# EasyEDA Pro project sony_flash.eprj

# Schematic Schematic1
Board Name: Board1; Create Date: 2025-07-01; Page Name: P1; Project Name: sony_flash; Schematic Name: Schematic1; Update Date: 2025-09-16; Company: 嘉立创EDA; Page Size: A4; Version: V1.0
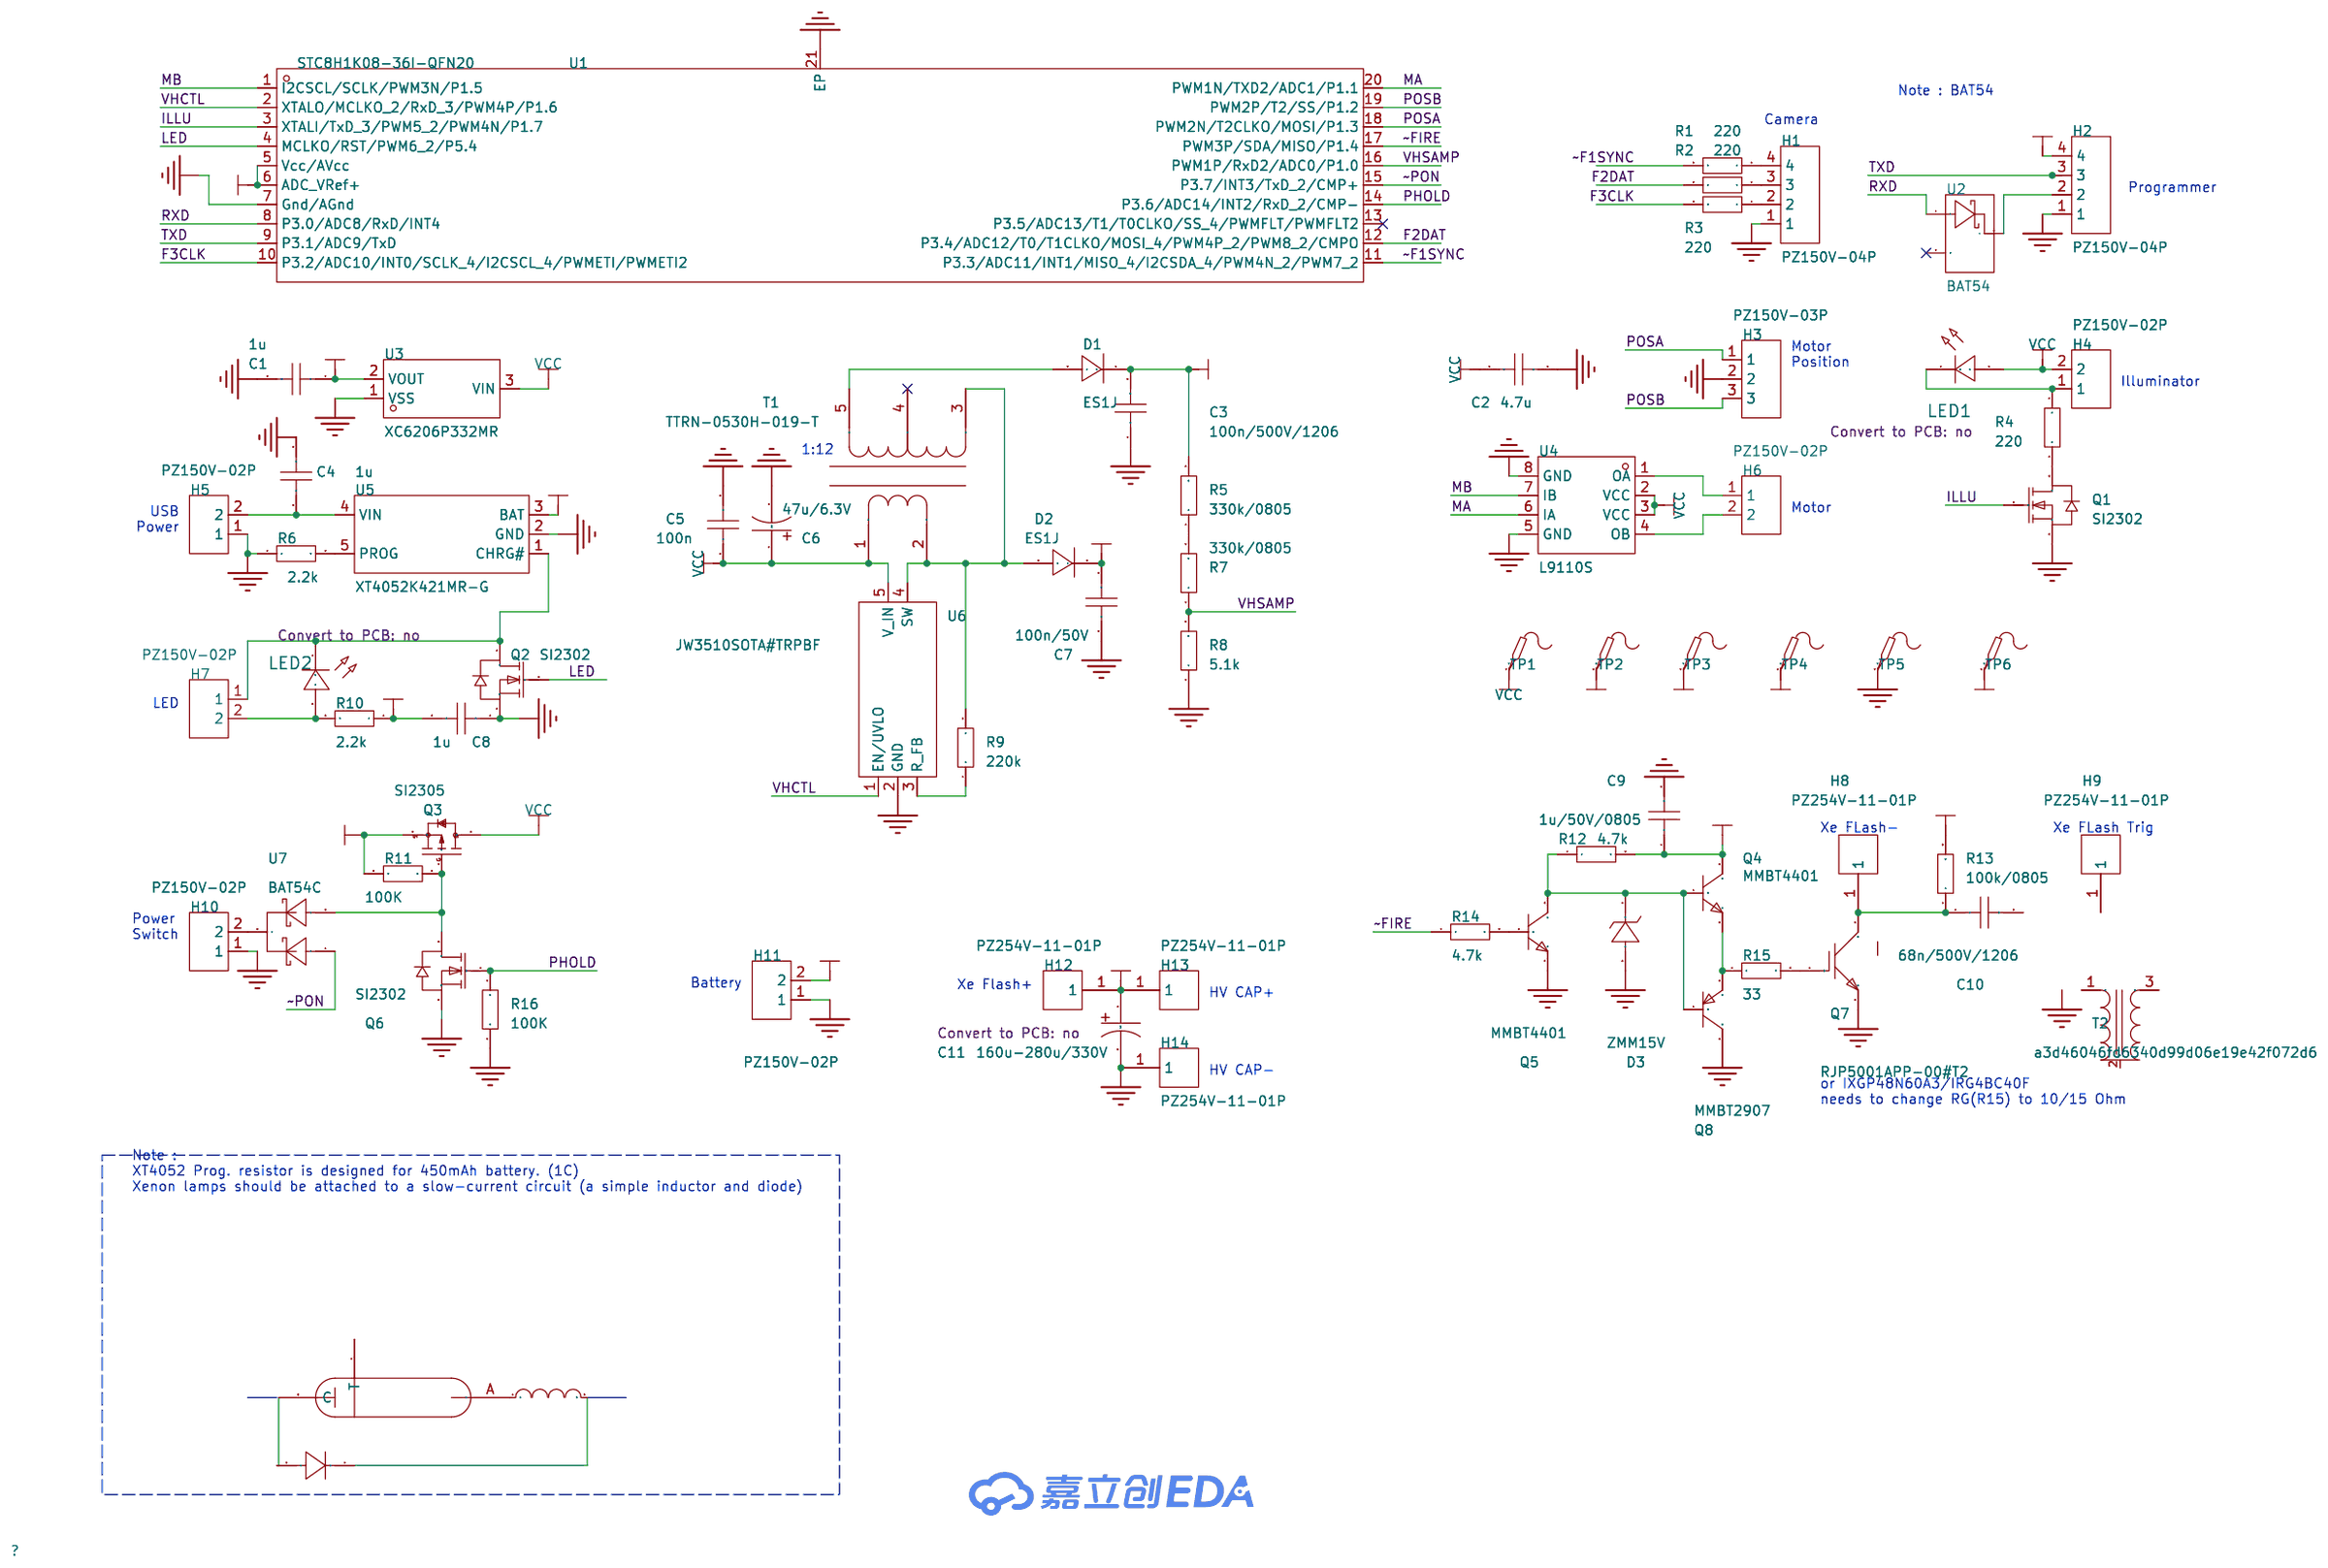
[diagram p0: schematic sheet]

## Parts
C1  1u  [C0603]
C2  4.7u  [C0603]
C3  100n/500V/1206  [C1206]
C4  1u  [C0603]
C5  100n  [C0603]
C6  47u/6.3V  [CAP-SMD_L3.2-W1.6]
C7  100n/50V  [C0603]
C8  1u  [C0603]
C9  1u/50V/0805  [C0805]
C10  68n/500V/1206  [C1206]
C11  160u-280u/330V  [CAP-TH_BD8.0-P3.50-D0.6-FD-2]
D1  ES1J  [SMA_L4.3-W2.7-LS5.0-RD]
D2  ES1J  [SMA_L4.3-W2.7-LS5.0-RD]
D3  ZMM15V  [LL-34_L3.5-W1.5-RD]
H1  PZ150V-04P  [HDR-TH_9P-P1.50_PZ150V-04P]
H2  PZ150V-04P  [HDR-TH_9P-P1.50_PZ150V-04P]
H3  PZ150V-03P  [HDR-TH_3P-P1.50-V-M]
H4  PZ150V-02P  [HDR-TH_2P-P1.50-V-M]
H5  PZ150V-02P  [HDR-TH_2P-P1.50-V-M]
H6  PZ150V-02P  [HDR-TH_2P-P1.50-V-M]
H7  PZ150V-02P  [HDR-TH_2P-P1.50-V-M]
H8  PZ254V-11-01P  [HDR-TH_1P-P2.54-V-M]
H9  PZ254V-11-01P  [HDR-TH_1P-P2.54-V-M]
H10  PZ150V-02P  [HDR-TH_2P-P1.50-V-M]
H11  PZ150V-02P  [HDR-TH_2P-P1.50-V-M]
H12  PZ254V-11-01P  [HDR-TH_1P-P2.54-V-M]
H13  PZ254V-11-01P  [HDR-TH_1P-P2.54-V-M]
H14  PZ254V-11-01P  [HDR-TH_1P-P2.54-V-M]
L1  10uH  [L0603]
LED1  -  [LED_0603]
LED2  -  [LED_0603]
Q1  SI2302  [SOT-23-3_L2.9-W1.3-P1.90-LS2.4-BR]
Q2  SI2302  [SOT-23-3_L2.9-W1.3-P1.90-LS2.4-BR]
Q3  SI2305  [SOT-23-3_L2.9-W1.3-P1.90-LS2.4-BR]
Q4  MMBT4401  [SOT-23-3_L2.9-W1.3-P1.90-LS2.4-BR]
Q5  MMBT4401  [SOT-23-3_L2.9-W1.3-P1.90-LS2.4-BR]
Q6  SI2302  [SOT-23-3_L2.9-W1.3-P1.90-LS2.4-BR]
Q7  RJP5001APP-00#T2  [TO-220-3_L9.9-W4.5-P2.54-L-1]
Q8  MMBT2907  [SOT-23-3_L2.9-W1.3-P1.90-LS2.4-BR]
R1  220  [R0603]
R2  220  [R0603]
R3  220  [R0603]
R4  220  [R0603]
R5  330k/0805  [R0805]
R6  2.2k  [R0603]
R7  330k/0805  [R0805]
R8  5.1k  [R0603]
R9  220k  [R0603]
R10  2.2k  [R0603]
R11  100K  [R0603]
R12  4.7k  [R0603]
R13  100k/0805  [R0805]
R14  4.7k  [R0603]
R15  33  [R0603]
R16  100K  [R0603]
T1  TTRN-0530H-019-T  [XFMR-SMD_TTRN-0530H-019-T]
T2  a3d46046fd6340d99d06e19e42f072d6  [TTRG-HF8124]
TP1  -  [Test-Point-0.5mm]
TP2  -  [Test-Point-0.5mm]
TP3  -  [Test-Point-0.5mm]
TP4  -  [Test-Point-0.5mm]
TP5  -  [Test-Point-0.5mm]
TP6  -  [Test-Point-0.5mm]
U1  STC8H1K08-36I-QFN20  [QFN-20_L3.0-W3.0-P0.40-BL-EP1.7]
U2  BAT54  [SOT-23-3_L2.9-W1.4-P1.90-LS2.5-BR]
U3  XC6206P332MR  [SOT-23-3_L3.0-W1.7-P0.95-LS2.9-BR]
U4  L9110S  [SOP-8_L6.1-W3.9-P1.27-LS6.0-BL-1]
U5  XT4052K421MR-G  [SOT-23-5_L2.9-W1.6-P0.95-LS2.8-BL]
U6  JW3510SOTA#TRPBF  [SOT-23-5_L2.9-W1.6-P0.95-LS2.8-BL]
U7  BAT54C  [SOT-23-3_L2.9-W1.3-P1.90-LS2.8-BR]
U8  1N4007  [SMA_L4.3-W2.6-LS5.1-RD]
X1  -

## Library data of the parts
C1-C5 C7-C10 = CAP_0603: Supplier Footprint: 0603
C6 = TC211A476K010B: LCSC Part Name: 47uF ±10% 10V; Supplier Part: C190384; Manufacturer: Sunlord(顺络); Supplier Footprint: CASE-A-3216-18(mm); JLCPCB Part Class: 扩展库; Datasheet: https://atta.szlcsc.com/upload/public/pdf/source/20231030/DDA5D10C6B7FCAF98AC7C23C2BD0B0CB.pdf; Supplier: LCSC; Tolerance: ±10%; Voltage Rating: 10V; Equivalent Series Resistance(ESR): 4Ω@100kHz; Operating Temperature: -55℃~+125℃
C11 = RGA4R7M2VBK-0811: LCSC Part Name: 4.7uF ±20% 350V; Supplier Part: C134606; Manufacturer: lelon(立隆); Supplier Footprint: 插件,D8xL11.5mm; JLCPCB Part Class: 扩展库; Datasheet: https://atta.szlcsc.com/upload/public/pdf/source/20190827/C416346_445A0B7A49AD27A9C1655D2C5BBCA321.pdf; Supplier: LCSC; Tolerance: ±20%; Voltage Rated: 350V; Lead Spacing: 3.5mm; Diameter: 8mm; Height - Seated (Max): 11.5mm; Lifetime @ Temp: 2000hrs@105℃
D1 D2 = ES1J_C232830: LCSC Part Name: 电压:600V 电流:1A; Supplier Part: C232830; Manufacturer: onsemi(安森美); Supplier Footprint: SMA(DO-214AC); JLCPCB Part Class: 扩展库; Datasheet: https://atta.szlcsc.com/upload/public/pdf/source/20181222/C232830_170C599829A3CD8EADC545FC168A8F09.pdf; Supplier: LCSC; Forward Voltage (Vf@If): 1.7V@1A; Reverse Voltage (Vr): 600V; Rectified Current: 1A; Reverse Leakage Current: 5uA@600V; Reverse Recovery Time (trr): 35ns
D3 = ZMM15V_C5346000: LCSC Part Name: VR:15V VF:1V PD:0.5W; Supplier Part: C5346000; Manufacturer: HXY MOSFET(华轩阳电子); Supplier Footprint: LL-34; JLCPCB Part Class: 扩展库; Datasheet: https://atta.szlcsc.com/upload/public/pdf/source/20240618/B2783523EC61B784553D1AF42AF87F53.pdf; Supplier: LCSC; Diode Configuration: 独立式; Zener Voltage (Nom): 15V; Reverse Leakage Current (Ir): 100nA@1V; Zener Voltage (Range): 13.8V~15.6V; Power Dissipation: 500mW; Zener Impedance (Zzt): 30Ω
H1 H2 = PZ150V-04P: LCSC Part Name: 1x4P 间距:1.5mm 直插; Supplier Part: C7496730; Manufacturer: XFCN(兴飞); Supplier Footprint: 插件,P=1.5mm; JLCPCB Part Class: 扩展库; Datasheet: https://atta.szlcsc.com/upload/public/pdf/source/20240828/FF41AF5B231CBB7CD24E6F7259FBBE88.pdf; Supplier: LCSC; Pin Structure: 1x4P; Pitch: 1.5mm; Mounting Type: 直插; Number of Rows: 单排; Number of Pins: 4P
H3 = PZ150V-03P: LCSC Part Name: 1x3P 间距:1.5mm 直插; Supplier Part: C7496729; Manufacturer: XFCN(兴飞); Supplier Footprint: 插件,P=1.5mm; JLCPCB Part Class: Extended Part; Datasheet: https://atta.szlcsc.com/upload/public/pdf/source/20240828/FF41AF5B231CBB7CD24E6F7259FBBE88.pdf; Supplier: LCSC; Pin Structure: 1x3P; Pitch: 1.5mm; Mounting Type: 直插; Number of Rows: 单排; Number of Pins: 3P
H4-H7 H10 H11 = PZ150V-02P: LCSC Part Name: 1x2P 间距:1.5mm 直插; Supplier Part: C7496728; Manufacturer: XFCN(兴飞); Supplier Footprint: 插件,P=1.5mm; JLCPCB Part Class: 扩展库; Datasheet: https://atta.szlcsc.com/upload/public/pdf/source/20240828/FF41AF5B231CBB7CD24E6F7259FBBE88.pdf; Supplier: LCSC; Pin Structure: 1x2P; Pitch: 1.5mm; Mounting Type: 直插; Number of Rows: 单排; Number of Pins: 2P
H8 H9 H12-H14 = PZ254V-11-01P: LCSC Part Name: 1x1P 间距:2.54mm 方针 直插; Supplier Part: C492400; Manufacturer: XFCN(兴飞); Supplier Footprint: 插件,P=2.54mm; JLCPCB Part Class: 扩展库; Datasheet: https://atta.szlcsc.com/upload/public/pdf/source/20200309/C492400_46876A5B545F5AE6B8D4A09C46E276E8.pdf; Supplier: LCSC; Pin Structure: 1x1P; Pitch: 2.54mm; Circluar Pins/Square Pins: 方针; Mounting Type: 直插; Number of Rows: 单排; Number of Pins: 1P; Length of Mating Pin: 6mm; Insulation Height: 2.5mm; Length of End Connection Pin: 3mm; Contact Material: 黄铜; Operating Temperature: -40℃~+105℃; Color: 黑色
L1 = L_0603
LED1 LED2 = LED_0603-R: Supplier Footprint: 0603
Q1 Q2 Q6 = SI2302_C2891732: LCSC Part Name: N沟道,电流:3A,耐压:20V; Supplier Part: C2891732; Manufacturer: YONGYUTAI(永裕泰); Supplier Footprint: SOT-23; JLCPCB Part Class: 扩展库; Datasheet: https://atta.szlcsc.com/upload/public/pdf/source/20210901/467BBA277A18343FF82D7D641AA41F7C.pdf; Supplier: LCSC; Type: 1个N沟道; Drain to Source Voltage: 20V; Current - Continuous Drain(Id): 3A; RDS(on): 50mΩ@4.5V,3A; Pd - Power Dissipation: 1W; Gate Threshold Voltage (Vgs(th)@Id): 1V; Input Capacitance(Ciss@Vds): 300pF@10V; Reverse Transfer Capacitance (Crss@Vds): 80pF@10V; Operating Temperature: -55℃~+150℃
Q3 = SI2305_C181088: LCSC Part Name: 1个P沟道 耐压:12V 电流:4.1A; Supplier Part: C181088; Manufacturer: Hottech(合科泰); Supplier Footprint: SOT-23; JLCPCB Part Class: 扩展库; Datasheet: https://item.szlcsc.com/datasheet/SI2305/192485.html; Supplier: LCSC; Number: 1个P沟道; Drain to Source Voltage: 12V; Current - Continuous Drain(Id): 4.1A; RDS(on): 45mΩ@4.5V,3.5A; Pd - Power Dissipation: 350mW; Gate Threshold Voltage (Vgs(th)): 900mV@250uA; Gate Charge(Qg): 15nC@4.5V; Input Capacitance(Ciss): 740pF; Operating Temperature: -55℃~+150℃; Output Capacitance(Coss): 290pF
Q4 Q5 = MMBT4401_C2891812: Supplier Part: C2891812; Manufacturer: YONGYUTAI(永裕泰); Supplier Footprint: SOT-23; JLCPCB Part Class: 扩展库; Datasheet: https://atta.szlcsc.com/upload/public/pdf/source/20210901/70CE6BC62B76BEBE9A44927DD63810C9.pdf; Supplier: LCSC; type: NPN; Current - Collector(Ic): 600mA; Collector - Emitter Voltage VCEO: 40V; Pd - Power Dissipation: 300mW; DC Current Gain: 300@150mA,1V; Transition frequency(fT): 250MHz; Current - Collector Cutoff: 100nA; Vce Saturation(VCE(sat)): 400mV
Q7 = RJP5001APP-00#T2: Supplier Part: C3171372; Manufacturer: RENESAS(瑞萨)/IDT; JLCPCB Part Class: 扩展库; Supplier: LCSC
Q8 = MMBT2907_C2891811: Supplier Part: C2891811; Manufacturer: YONGYUTAI(永裕泰); Supplier Footprint: SOT-23; JLCPCB Part Class: 扩展库; Datasheet: https://atta.szlcsc.com/upload/public/pdf/source/20210901/B83893FAF7854DBD9CFE3943D8542502.pdf; Supplier: LCSC; type: PNP; Current - Collector(Ic): 600mA; Collector - Emitter Voltage VCEO: 60V; Pd - Power Dissipation: 225mW; DC Current Gain: 400@150mA,10V; Current - Collector Cutoff: 1uA; Vce Saturation(VCE(sat)): 400mV
R1-R16 = Res_0603: Supplier Footprint: 0603
T1 = TTRN-0530H-019-T: Supplier Part: C9900002320; Supplier Footprint: SMD; JLCPCB Part Class: 扩展库; Supplier: LCSC
T2 = TTRG-HF8124
TP1-TP6 = Test-Point
U1 = STC8H1K08-36I-QFN20: LCSC Part Name: 宽电压/高速/高可靠/低功耗/强抗静电/较强抗干扰的新一代 8051 单片机; Supplier Part: C915674; Manufacturer: STC; Supplier Footprint: QFN-20-EP(3x3); JLCPCB Part Class: 扩展库; Datasheet: https://atta.szlcsc.com/upload/public/pdf/source/20241226/4D2D43D1C972E3DE0CD105735CEEAD95.pdf; Supplier: LCSC; CPU Core: 51系列; Program Storage Size: 8KB; Program Memory Type: FLASH; Number of I/O: 17; ADC (Bit): 10bit; PWM (Bit): 16bit; Low Voltage Detection Threshold: 1.9V~5.5V
U2 = BAT54_C22466368: LCSC Part Name: 电压:30V 电流:200mA; Supplier Part: C22466368; Manufacturer: 宏嘉诚; Supplier Footprint: SOT-23; JLCPCB Part Class: 扩展库; Datasheet: https://atta.szlcsc.com/upload/public/pdf/source/20250121/A263DE00CCBA17D340DF4D7850190654.pdf; Supplier: LCSC; Diode Configuration: 独立式; Voltage - Forward(Vf@If): 1V@100mA; Voltage - DC Reverse(Vr): 30V; Current - Rectified: 200mA; Reverse Leakage Current (Ir): 2uA@25V
U3 = XC6206P332MR_C347376: LCSC Part Name: 高纹波抑制率、低功耗、低压差 CMOS 降压型电压稳压器; Supplier Part: C347376; Manufacturer: UMW(友台半导体); Supplier Footprint: SOT-23; JLCPCB Part Class: 扩展库; Datasheet: https://atta.szlcsc.com/upload/public/pdf/source/20241029/DFB0998C0588718C146C8B83CE14F55A.pdf; Supplier: LCSC; Output Type: 固定; Maximum Input Voltage: 8V; Output Voltage: 3.3V; Output Current: 250mA; Power Supply Rejection Ratio (PSRR): 40dB@(1kHz); Dropout Voltage: 240mV@(50mA); Feature: 过流保护(OCP)；短路保护; Operating Temperature: -25℃~+80℃; Output Polarity: 正极; Number of Outputs: 1
U4 = L9110S_C725793: LCSC Part Name: 低功耗; Supplier Part: C725793; Manufacturer: UMW(友台半导体); Supplier Footprint: SOP-8; JLCPCB Part Class: 扩展库; Datasheet: https://atta.szlcsc.com/upload/public/pdf/source/20231109/1204DFCF28666E4B22D527BCEE7768BD.pdf; Supplier: LCSC
U5 = XT4052K421MR-G: Supplier Part: C219048; Manufacturer: natlinear(南麟); Supplier Footprint: SOT-23-5L; JLCPCB Part Class: 扩展库; Supplier: LCSC
U6 = JW3510SOTA#TRPBF: LCSC Part Name: 输入电压42V，带65V/1.4A开关的微功耗无光电隔离反激式转换器; Supplier Part: C5357402; Manufacturer: Joulwatt(杰华特); Supplier Footprint: SOT-23-5; JLCPCB Part Class: 扩展库; Datasheet: https://item.szlcsc.com/datasheet/JW3510SOTA%2523TRPBF/6164472.html; Supplier: LCSC; Voltage - Supply: 3V~42V; Frequency - Switching: 7kHz~430kHz; Operating Temperature: -40℃~+125℃@(TJ); Number of Outputs: 1; Topology: 反激式; Switch tube (built-in/external): 内置; Output Type: 可调
U7 = BAT54C_C22466350: LCSC Part Name: 电压:30V 电流:200mA; Supplier Part: C22466350; Manufacturer: 宏嘉诚; Supplier Footprint: SOT-23; JLCPCB Part Class: 扩展库; Datasheet: https://atta.szlcsc.com/upload/public/pdf/source/20250121/A263DE00CCBA17D340DF4D7850190654.pdf; Supplier: LCSC; Diode Configuration: 独立式; Voltage - Forward(Vf@If): 1V@100mA; Voltage - DC Reverse(Vr): 30V; Current - Rectified: 200mA; Reverse Leakage Current (Ir): 2uA@25V
U8 = 1N4007: Supplier Part: C9900004759; JLCPCB Part Class: Extended Part; Supplier: LCSC
X1 = XeonTube

## Nets
GND: C1.2 C2.1 C3.1 C4.1 C5.2 C6.2 C7.1 C8.1 C9.2 C11.2 D3.2(A) H1.1 H2.1 H3.2 H5.1 H10.1 H11.1 H14.1 Q1.2(S) Q2.2(S) Q5.2(E) Q6.2(S) Q7.3(E) Q8.3(C) R6.1 R8.1 R16.2 TP5.1 U1.7(Gnd/AGnd) U1.21(EP) U3.1(VSS) U4.5(GND) U4.8(GND) U5.2(GND) U6.2(GND)
V33: C1.1 H2.4 TP6.1 U1.5(Vcc/AVcc) U1.6(ADC_VRef+) U3.2(VOUT)
VBAT: C8.2 H11.2 Q3.2(S) R10.1 R11.2 TP4.1 U5.3(BAT)
VCC: C2.2 C5.1 C6.1 H4.2 LED1.2(A) Q3.3(D) T1.1 TP1.1 U3.3(VIN) U4.2(VCC) U4.3(VCC) U6.5(V_IN)
F2DAT: R2.2 U1.12(P3.4/ADC12/T0/T1CLKO/MOSI_4/PWM4P_2/PWM8_2/CMPO)
F3CLK: R3.2 U1.10(P3.2/ADC10/INT0/SCLK_4/I2CSCL_4/PWMETI/PWMETI2)
ILLU: Q1.1(G) U1.3(XTALI/TxD_3/PWM5_2/PWM4N/P1.7)
LED: Q2.1(G) U1.4(MCLKO/RST/PWM6_2/P5.4)
MA: U1.20(PWM1N/TXD2/ADC1/P1.1) U4.6(IA)
MB: U1.1(I2CSCL/SCLK/PWM3N/P1.5) U4.7(IB)
PHOLD: Q6.1(G) R16.1 U1.14(P3.6/ADC14/INT2/RxD_2/CMP-)
POSA: H3.1 U1.18(PWM2N/T2CLKO/MOSI/P1.3)
POSB: H3.3 U1.19(PWM2P/T2/SS/P1.2)
RXD: U1.8(P3.0/ADC8/RxD/INT4) U2.1(A)
TXD: H2.3 U1.9(P3.1/ADC9/TxD)
VH: C3.2 C11.1 D1.1(K) H12.1 H13.1 R5.2 R13.2 TP2.1
VHCTL: U1.2(XTALO/MCLKO_2/RxD_3/PWM4P/P1.6) U6.1(EN/UVLO)
VHSAMP: R7.1 R8.2 U1.16(PWM1P/RxD2/ADC0/P1.0)
VM: C7.2 C9.1 D2.1(K) Q4.3(C) R12.2 TP3.1
~F1SYNC: R1.2 U1.11(P3.3/ADC11/INT1/MISO_4/I2CSDA_4/PWM4N_2/PWM7_2)
~FIRE: R14.1 U1.17(PWM3P/SDA/MISO/P1.4)
~PON: U1.15(P3.7/INT3/TxD_2/CMP+) U7.1(A)
$1N643: D2.2(A) R9.2 T1.2 T1.3 U6.4(SW)
$1N5863: R6.2 U5.5(PROG)
$1N5963: C4.2 H5.2 U5.4(VIN)
$1N6542: C10.1 H8.1 Q7.2(C) R13.1
$1N7917: H6.1 U4.1(OA)
$1N7926: H6.2 U4.4(OB)
$1N11768: D3.1(K) Q4.1(B) Q5.3(C) Q8.1(B) R12.1
$1N12606: H1.4 R1.1
$1N12608: H1.3 R2.1
$1N12610: H1.2 R3.1
$1N12900: Q1.3(D) R4.1
$1N13119: Q5.1(B) R14.2
$1N19831: Q3.1(G) Q6.3(D) R11.1 U7.2(A)
$1N20494: Q4.2(E) Q8.2(E) R15.1
$1N20508: Q7.1(G) R15.2
$1N20541: R5.1 R7.2
$1N21098: D1.2(A) T1.5
$1N21327: H2.2 U2.3(K)
$1N21479: H10.2 U7.3(K)
$1N28229: R9.1 U6.3(R_FB)
Net-(H4-1): H4.1 LED1.1(C) R4.2
Net-(H7-1): H7.1 LED2.1(C) Q2.3(D) U5.1(CHRG#)
Net-(H7-2): H7.2 LED2.2(A) R10.2
Net-(L1-1): L1.1 X1.A
Net-(L1-2): L1.2 U8.1(K)
Net-(U8-2): U8.2(A) X1.C

Not connected (* = marked no-connect by the designer): C10 2; H9 1; T1 4*; T2 1 2 3; U1 13(P3.5/ADC13/T1/T0CLKO/SS_4/PWMFLT/PWMFLT2)*; U2 2*; X1 T

## Notes on the sheet
- Note : BAT54
- Camera
- Programmer
- Motor
  Position
- Illuminator
- 1:12
- Motor
- USB
  Power
- LED
- Xe FLash-
- Xe FLash Trig
- Power
  Switch
- Xe Flash+
- Battery
- HV CAP+
- HV CAP-
- or IXGP48N60A3/IRG4BC40F
  needs to change RG(R15) to 10/15 Ohm
- Note :
  XT4052 Prog. resistor is designed for 450mAh battery. (1C)
  Xenon lamps should be attached to a slow-current circuit (a simple inductor and diode)

# Board PCB1
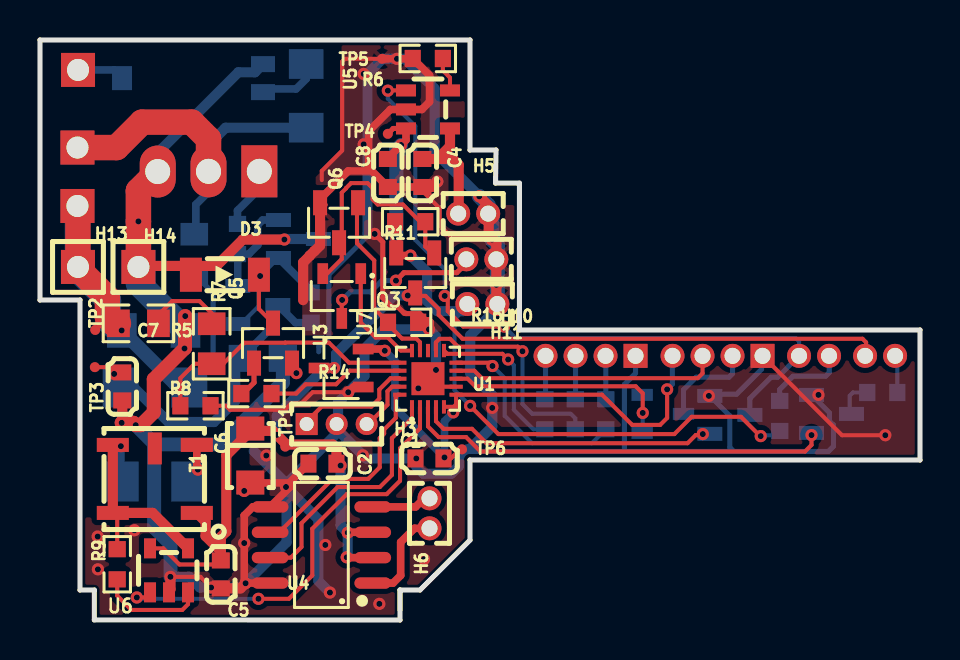
[diagram p1: board, top side]
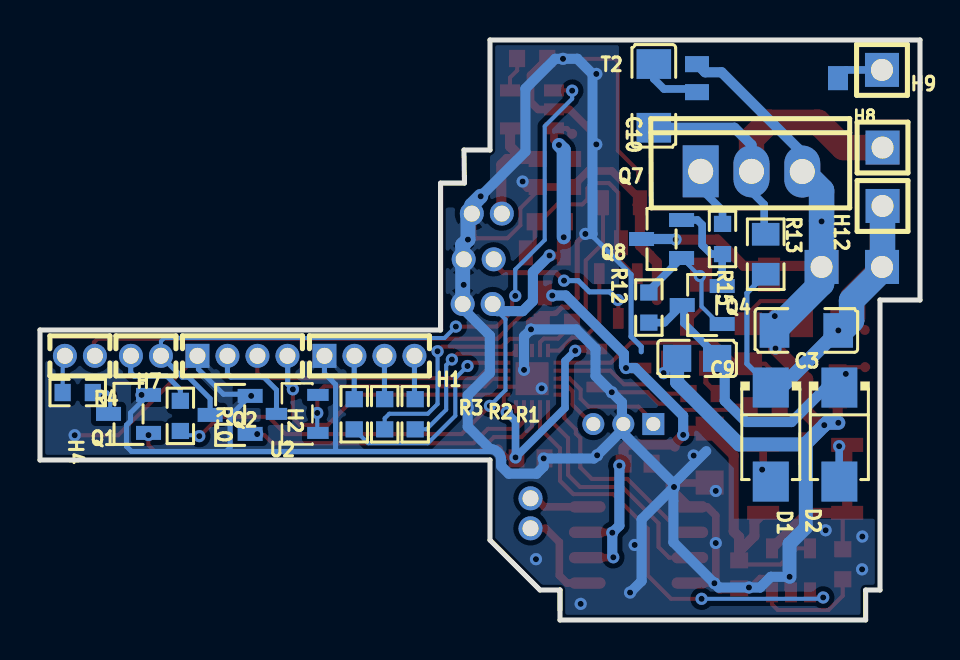
[diagram p2: board, bottom side, seen from below]

Outline 44 x 29 mm; copper layers: Top Layer, Bottom Layer. Coordinates in mm from the lower left corner of the outline.
Outline path: 18,1.5 18,0.51 ; 18,1.5 19,1.5 21.5,4 21.5,8 44,8 44,14.5 23.97,14.5 23.97,21.84 22.78,21.84 22.8,23.5 21.5,23.5 21.5,29 0,29 0,16 2,16 2,1.5 2.72,1.5 2.72,0 18,0 18,1.5
Stack: Top Layer 0.035mm / Dielectric1 1.51mm FR4 er 4.5 / Bottom Layer 0.035mm

## Design rules (mm)
template: 自定义配置
spacing copperThickness1oz (default): track to track 0.102, other pairs 0.152 to 0.3
spacing copperThickness2oz: track to track 0.203, other pairs 0.152 to 0.3
track width copperThickness1oz (default): min 0.127, default 0.203, max 2.54
track width copperThickness2oz: min 0.203, default 0.254, max 2.54
differential pair differentialPair (default): width min 0.127, default 0.254, max 2.54; gap min 0.152, default 0.152
via viaSize (default): diameter min 0.5, default 0.61, max 10; hole min 0.3, default 0.305, max 6.3

## Placement (name value [footprint] x y rotation side)
C1  1u  [C0603]  19.47 8.08 180 top
C2  4.7u  [C0603]  14.12 7.82 0 top
C3  100n/500V/1206  [C1206]  5.68 14.48 180 bottom
C4  1u  [C0603]  19.12 22.35 90 top
C5  100n  [C0603]  9.04 2.28 270 top
C6  47u/6.3V  [CAP-SMD_L3.2-W1.6]  10.52 8.22 270 top
C7  100n/50V  [C0603]  4.12 11.68 90 top
C8  1u  [C0603]  17.39 22.35 90 top
C9  1u/50V/0805  [C0805]  11.14 13.08 0 bottom
C10  68n/500V/1206  [C1206]  13.31 26.21 90 bottom
D1  ES1J  [SMA_L4.3-W2.7-LS5.0-RD]  7.46 9.27 270 bottom
D2  ES1J  [SMA_L4.3-W2.7-LS5.0-RD]  4.03 9.27 270 bottom
D3  ZMM15V  [LL-34_L3.5-W1.5-RD]  9.25 17.27 180 top
H1  PZ150V-04P  [HDR-TH_9P-P1.50_PZ150V-04P]  27.53 13.21 180 bottom
H2  PZ150V-04P  [HDR-TH_9P-P1.50_PZ150V-04P]  33.88 13.21 180 bottom
H3  PZ150V-03P  [HDR-TH_3P-P1.50-V-M]  14.83 9.8 0 top
H4  PZ150V-02P  [HDR-TH_2P-P1.50-V-M]  42 13.21 180 bottom
H5  PZ150V-02P  [HDR-TH_2P-P1.50-V-M]  21.66 20.32 180 top
H6  PZ150V-02P  [HDR-TH_2P-P1.50-V-M]  19.47 5.33 90 top
H7  PZ150V-02P  [HDR-TH_2P-P1.50-V-M]  38.7 13.21 0 bottom
H8  PZ254V-11-01P  [HDR-TH_1P-P2.54-V-M]  1.87 23.62 180 bottom
H9  PZ254V-11-01P  [HDR-TH_1P-P2.54-V-M]  1.9 27.5 270 bottom
H10  PZ150V-02P  [HDR-TH_2P-P1.50-V-M]  22.07 18.03 180 top
H11  PZ150V-02P  [HDR-TH_2P-P1.50-V-M]  22.12 15.8 180 top
H12  PZ254V-11-01P  [HDR-TH_1P-P2.54-V-M]  1.87 20.7 180 bottom
H13  PZ254V-11-01P  [HDR-TH_1P-P2.54-V-M]  1.9 17.65 0 top
H14  PZ254V-11-01P  [HDR-TH_1P-P2.54-V-M]  4.92 17.65 0 top
Q1  SI2302  [SOT-23-3_L2.9-W1.3-P1.90-LS2.4-BR]  39.57 10.31 180 bottom
Q2  SI2302  [SOT-23-3_L2.9-W1.3-P1.90-LS2.4-BR]  34.49 10.25 180 bottom
Q3  SI2305  [SOT-23-3_L2.9-W1.3-P1.90-LS2.4-BR]  18.76 17.35 90 top
Q4  MMBT4401  [SOT-23-3_L2.9-W1.3-P1.90-LS2.4-BR]  10.89 15.75 180 bottom
Q5  MMBT4401  [SOT-23-3_L2.9-W1.3-P1.90-LS2.4-BR]  11.65 13.84 270 top
Q6  SI2302  [SOT-23-3_L2.9-W1.3-P1.90-LS2.4-BR]  14.95 19.86 90 top
Q7  RJP5001APP-00#T2  [TO-220-3_L9.9-W4.5-P2.54-L-1]  8.43 22.43 180 bottom
Q8  MMBT2907  [SOT-23-3_L2.9-W1.3-P1.90-LS2.4-BR]  12.92 19.05 180 bottom
R1  220  [R0603]  25.24 10.29 270 bottom
R2  220  [R0603]  26.76 10.29 270 bottom
R3  220  [R0603]  28.29 10.29 270 bottom
R4  220  [R0603]  42.11 11.37 0 bottom
R5  330k/0805  [R0805]  4.92 14.83 180 top
R6  2.2k  [R0603]  19.39 28.08 0 top
R7  330k/0805  [R0805]  8.59 13.81 90 top
R8  5.1k  [R0603]  7.77 10.71 180 top
R9  220k  [R0603]  3.86 2.79 90 top
R10  2.2k  [R0603]  36.98 10.2 90 bottom
R11  100K  [R0603]  18.51 19.91 180 top
R12  4.7k  [R0603]  13.56 15.62 270 bottom
R13  100k/0805  [R0805]  7.72 18.29 270 bottom
R14  4.7k  [R0603]  10.82 11.32 180 top
R15  33  [R0603]  9.87 19.05 90 bottom
R16  100K  [R0603]  18.15 14.88 0 top
T1  TTRN-0530H-019-T  [XFMR-SMD_TTRN-0530H-019-T]  5.74 7.05 180 top
T2  a3d46046fd6340d99d06e19e42f072d6  [TTRG-HF8124]  11.53 28.54 180 bottom
TP1  -  [Test-Point-0.5mm]  12.26 8.67 0 top
TP2  -  [Test-Point-0.5mm]  2.76 14.5 0 top
TP3  -  [Test-Point-0.5mm]  2.74 12.64 0 top
TP4  -  [Test-Point-0.5mm]  17.39 24.31 0 top
TP5  -  [Test-Point-0.5mm]  17.11 28.06 0 top
TP6  -  [Test-Point-0.5mm]  21.1 8.53 0 top
U1  STC8H1K08-36I-QFN20  [QFN-20_L3.0-W3.0-P0.40-BL-EP1.7]  19.4 12.06 0 top
U2  BAT54  [SOT-23-3_L2.9-W1.4-P1.90-LS2.5-BR]  31.14 10.31 180 bottom
U3  XC6206P332MR  [SOT-23-3_L3.0-W1.7-P0.95-LS2.9-BR]  15.06 12.6 0 top
U4  L9110S  [SOP-8_L6.1-W3.9-P1.27-LS6.0-BL-1]  14.07 3.75 90 top
U5  XT4052K421MR-G  [SOT-23-5_L2.9-W1.6-P0.95-LS2.8-BL]  19.4 25.53 270 top
U6  JW3510SOTA#TRPBF  [SOT-23-5_L2.9-W1.6-P0.95-LS2.8-BL]  6.45 2.48 0 top
U7  BAT54C  [SOT-23-3_L2.9-W1.3-P1.90-LS2.8-BR]  15.09 16.2 90 top

## Footprints (pads in the part's own frame, mm; a bottom-side part is the same pattern mirrored in y, then rotated)
C0603
  rect 0.8x0.9 smd: 1(-0.7,0) 2(0.7,0)
C0805
  rect 1.41x1.35 smd: 1(-1,0) 2(1,0)
C1206
  rect 1.485x1.728 smd: 1(-1.593,0) 2(1.593,0)
CAP-SMD_L3.2-W1.6
  rect 1.2x1.4 smd: 1(-1.35,0) 2(1.35,0)
HDR-TH_1P-P2.54-V-M
  rect 1.7x1.7 hole 1.1: 1(0,0)
HDR-TH_2P-P1.50-V-M
  round 1.2 hole 0.8: 1(-0.75,0) 2(0.75,0)
HDR-TH_3P-P1.50-V-M
  rect 1.1x1.1 hole 0.7: 1(-1.5,0)
  round 1.1 hole 0.7: 2(0,0) 3(1.5,0)
HDR-TH_9P-P1.50_PZ150V-04P
  rect 1.2x1.2 hole 0.8: 1(-2.25,0)
  round 1.2 hole 0.8: 2(-0.75,0) 3(0.75,0) 4(2.25,0)
LL-34_L3.5-W1.5-RD
  rect 1.1x1.7 smd: 1(-1.7,0) 2(1.7,0)
QFN-20_L3.0-W3.0-P0.40-BL-EP1.7
  rect 0.2x0.665 smd: 1(-0.8,-1.407) 2(-0.4,-1.407) 3(0,-1.407) 4(0.4,-1.407) 5(0.8,-1.407) 11(0.8,1.407) 12(0.4,1.407) 13(0,1.407) 14(-0.4,1.407) 15(-0.8,1.407)
  rect 0.665x0.2 smd: 6(1.407,-0.8) 7(1.407,-0.4) 8(1.407,0) 9(1.407,0.4) 10(1.407,0.8) 16(-1.407,0.8) 17(-1.407,0.4) 18(-1.407,0) 19(-1.407,-0.4) 20(-1.407,-0.8)
  rect 1.65x1.65 smd: 21(0,0)
R0603
  rect 0.806x0.864 smd: 1(-0.753,0) 2(0.753,0)
R0805
  rect 1.133x1.377 smd: 1(-1,0) 2(1,0)
SMA_L4.3-W2.7-LS5.0-RD
  rect 2x1.8 smd: 1(-2.35,0) 2(2.35,0)
SOP-8_L6.1-W3.9-P1.27-LS6.0-BL-1
  oval 0.569x1.834 smd: 1(-1.905,-2.566) 2(-0.635,-2.566) 3(0.635,-2.566) 4(1.905,-2.566) 5(1.905,2.566) 6(0.635,2.566) 7(-0.635,2.566) 8(-1.905,2.566)
SOT-23-3_L2.9-W1.3-P1.90-LS2.4-BR
  rect 1.25x0.7 smd: 1(1,-0.95) 2(1,0.95) 3(-1,0)
SOT-23-3_L2.9-W1.3-P1.90-LS2.8-BR
  rect 1.04x0.532 smd: 1(1.12,-0.95) 2(1.12,0.95) 3(-1.12,0)
SOT-23-3_L2.9-W1.4-P1.90-LS2.5-BR
  rect 1.07x0.6 smd: 1(1.035,-0.95) 2(1.035,0.95) 3(-1.035,0)
SOT-23-3_L3.0-W1.7-P0.95-LS2.9-BR
  rect 1.038x0.532 smd: 1(1.101,-0.95) 2(1.101,0.95) 3(-1.101,0)
SOT-23-5_L2.9-W1.6-P0.95-LS2.8-BL
  rect 0.6x1 smd: 1(-0.95,-1.1) 2(0,-1.1) 3(0.95,-1.1) 4(0.95,1.1) 5(-0.95,1.1)
Test-Point-0.5mm
  round 0.5 smd: 1(0,0)
TO-220-3_L9.9-W4.5-P2.54-L-1
  rect 1.8x2.6 hole 1.25: 1(-2.54,0.005)
  oval 1.8x2.6 hole 1.25: 2(0,0.005) 3(2.54,-0.005)
TTRG-HF8124
  rect 1.2x0.8 smd: 1(0.381,-2.15) 2(0.381,-0.75)
  rect 1x1.2 smd: 3(7.431,-1.45)
XFMR-SMD_TTRN-0530H-019-T
  rect 1.6x0.7 smd: 1(-2.1,1.7) 2(2.1,1.7) 3(2.1,-1.7) 5(-2.1,-1.7)
  rect 0.7x1.6 smd: 4(0,-1.524)

## Nets
As in the schematic, except:
GND: C1.2 C2.1 C3.1 C4.1 C5.2 C6.2 C7.1 C8.1 C9.2 D3.2 H1.1 H2.1 H3.2 H5.1 H10.1 H11.1 H14.1 Q1.2 Q2.2 Q5.2 Q6.2 Q7.3 Q8.3 R6.1 R8.1 R16.2 T2.2 TP5.1 U1.7 U1.21 U3.1 U4.5 U4.8 U5.2 U6.2
$1N9133: H7.1 Q2.3 U5.1
$1N9861: H4.1 R4.2
$1N10113: H7.2 R10.2
$1N13261: C10.2 T2.1
$1N13316: H9.1 T2.3

Pads without a net: T1 4; U1 13; U2 2

## Via types
v1: diameter 0.61, hole 0.305, Top Layer to Bottom Layer, 72 vias

## Routing (per net, layer and track width the routed paths; a pad name or vN(x,y) marks a point on that pad's centre or on a via; arc(x,y) is an arc through that point)
GND: length 257
  Top Layer w0.203: H2.1 40.1,9.24 v1(42.27,9.24) ; TP5.1 15.25,28.06 15.11,27.92 15.11,23.47 14.09,22.45 14.09,22 ; v1(6.52,2.16) 8.02,2.16 v1(8.55,1.63) ; U1.7 19.8,11.67 U1.21 ; R8.1 9.3,10.71 9.5,10.51 12.24,10.51 12.55,10.81 13.06,10.81 13.63,11.39 v1(15.41,11.39) ; 5.44,17.14 H14.1 ; 22.44,19.24 22.28,19.09 22.15,19.09 22.15,19.09 20.63,19.09 19.98,19.73 19.98,20.58 19.12,21.45 C4.1 19.09,21.68
  Top Layer w0.254: 14.16,20.86 14.26,20.76 ; 19.42,14.88 18.99,15.32 18.3,15.32 18.28,15.34 18.21,15.34 17.9,15.65 17.6,15.65 17.14,16.1 17.14,18.9 v1(16.73,19.3)
  Top Layer w0.381: U4.8 10.29,1.85 ; TP5.1 v1(17.85,28.06) 18.62,28.06 R6.1 19.47,27.24 19.47,25.91 19.09,25.53 U5.2 17.52,25.53 16.43,24.44 16.43,22.62 16.59,22.45 ; 10.64,6.85 12.46,6.85 C2.1 13.49,7.82 13.57,7.91 ; 19.09,21.68 19.07,21.65 C8.1 ; 16.59,22.45 15.41,22.45 14.16,21.2 14.16,20.86 ; 16.59,22.45 C8.1 ; C8.1 17.24,21.65 ; v1(15.41,11.39) 15.67,11.65 U3.1 ; 10.24,1.9 10.21,1.93 v1(10.21,3.85) 10.21,5.23 10.64,5.66 U4.5 12.52,6.67 12.52,6.78 ; 6.09,23.29 6.09,22.63
  Top Layer w0.508: H14.1 4.97,17.7 8.82,17.7 10.14,19.02 v1(12.22,19.02) ; R16.2 19.42,14.88 19.45,14.86 v1(19.45,14.53) ; 13.16,16 13.16,17.88 13.48,18.2 13.48,18.22 13.72,18.45 13.74,18.45 14,18.72 Q6.2 ; v1(19.87,21.92) 19.6,21.65 C4.1 ; v1(6.52,2.16) 6.52,1.54 6.45,1.47 U6.2 ; v1(8.55,1.63) 9,1.63 C5.2 10.02,1.58 10.29,1.85 ; v1(4.08,9.86) 4.12,9.89 C7.1 ; 22.82,15.62 v1(22.82,16.76) H10.1 22.82,18.81 22.44,19.19 22.44,20.29 H5.1 22.41,20.74 v1(21.96,21.18)
  Top Layer w0.7: v1(4.08,9.86) 4.67,9.86 v1(4.79,9.74) 5.04,9.74 5.69,10.39 5.69,12.04 v1(7.23,13.58) 7.25,13.6 7.25,15.18 v1(7.26,15.2)
  Top Layer w1.27: Q7.3 4.92,21.46 v1(4.92,19.93) H14.1
  Bottom Layer w0.254: Q1.2 39.47,10.36 39.47,9.95 39.68,9.75 39.68,8.68 39.42,8.43 34.7,8.43 ; 16.47,19.3 14.45,17.27 14.45,14.17 13.94,13.67 13.94,13.41 ; 34.7,8.43 29.22,8.43 ; 34.7,8.43 34.49,8.63 34.49,10.21 33.49,11.2 ; 29.22,8.43 21.41,8.43 ; 29.22,8.43 29.22,11.78 29.78,12.33 H1.1 ; H2.1 36.08,13.16 36.08,12.54 34.83,11.29 33.58,11.29 Q2.2
  Bottom Layer w0.508: v1(16.73,19.3) 16.73,19.3 16.38,19.3 16.38,27.3 17.13,28.06 v1(17.85,28.06) 18.24,28.06 19.73,26.57 19.73,23.42 v1(21.96,21.18) ; v1(12.22,19.02) 12.25,19.05 Q8.3 ; 12.33,6.8 12.33,6.62 ; 12.33,6.8 10.69,8.44 ; 12.33,6.8 12.33,6.82 14.9,9.4 ; 12.33,6.62 12.33,3.89 v1(10.28,1.84) 10.07,1.63 v1(8.55,1.63) 8,1.63 7.46,2.16 v1(6.52,2.16) ; 12.33,6.62 13.92,5.03 13.92,1.95 v1(14.5,1.37) ; 12.33,6.62 v1(12.3,6.65) ; v1(19.8,12.5) 19.8,14.18 v1(19.45,14.53) 17.19,14.53 16.22,13.56 16.22,12.2 v1(15.41,11.39) 14.9,10.88 14.9,9.4 ; 14.9,9.4 14.98,9.4 16.3,8.08 v1(18.81,8.08) 18.81,7.67 19.17,7.31 20.56,7.31 20.94,7.7 20.94,8 20.95,8 arc(21.11,8.39) 21.5,8.55 22.61,9.67 v1(22.61,10.61) 22.61,11.24 21.51,12.34 21.51,14.22 22.87,15.58 ; T2.2 10.74,27.39 9.92,27.39 6.09,23.56 6.09,23.29 ; v1(7.23,13.58) 7.23,14.12 7.43,14.32 ; H5.1 22.6,20.13 ; C9.2 12.3,12.93
  Bottom Layer w0.7: v1(4.08,9.86) 4.67,9.86 v1(4.79,9.74) 5.71,8.82 ; 5.71,8.82 5.75,8.78 9.04,8.78 12.14,11.88 C9.2 ; 5.71,8.82 5.71,4.62 6.52,3.81 v1(6.52,2.16)
  Bottom Layer w0.75: 22.6,20.13 v1(22.6,19.02) 22.87,18.76 H11.1 ; v1(21.96,21.18) 22.41,20.74 H5.1
  Bottom Layer w1.27: Q7.3 4.92,21.46 v1(4.92,19.93) 4.92,16.83 C3.1
  vias: v1(2.88,4.17) v1(2.9,2.53) v1(4.72,4.49) v1(10.21,6.45) v1(11.32,8.22) v1(12.82,12.34) v1(14.27,3.75) v1(16.14,8.23) v1(16.18,27.3) v1(16.18,23.78) v1(16.97,0.81) v1(18.92,11.58) v1(19.2,3.04) v1(33.44,11.2) v1(38.92,11.26)
V33: length 27.2
  Top Layer w0.203: 21,8.53 20.54,8.08 20.18,8.08 ; v1(31.36,11.53) 31.36,10.1 31.01,9.75 29.61,9.75 28.1,11.27 U1.6 20.81,10.66 U1.5
  Top Layer w0.381: v1(17.24,13.46) 17.15,13.55 U3.2 ; 20.81,10.66 20.81,10.53 v1(20.66,10.38)
  Bottom Layer w0.254: H2.4 31.62,13.2 31.62,11.79 v1(31.36,11.53)
  Bottom Layer w0.381: v1(20.66,10.38) 20.22,9.94 v1(20.22,8.13) 17.75,10.6 17.75,12.95 v1(17.24,13.46)
VBAT: length 37.2
  Top Layer w0.203: v1(36.04,9.19) 36.01,9.19 35.04,10.16 32.58,10.16 31.72,9.3 22.92,9.3 v1(21.51,10.71)
  Top Layer w0.254: U5.3 17.66,24.58 TP4.1
  Top Layer w0.381: U5.3 18.3,24 v1(18.05,23.75) 17.35,23.05 17.24,23.05 ; v1(18.52,18.22) 17.81,18.22 v1(17.81,19.14) 17.81,19.86 R11.2
  Bottom Layer w0.203: R10.1 36.77,9.24 36.08,9.24 v1(36.04,9.19) ; 21.14,15.44 20.73,15.03 20.73,11.49 v1(21.51,10.71)
  Bottom Layer w0.508: 21.32,15.62 21.14,15.44 19.86,15.44 19.35,15.95 19.35,17.39 v1(18.52,18.22)
  Bottom Layer w0.7: v1(17.81,19.14) 17.81,23.51 v1(18.05,23.75)
VCC: length 61.9
  Top Layer w0.203: 18.76,16.22 18.78,16.2 19.27,16.2 19.93,15.55 19.93,15.26 21.13,14.06 41.13,14.06 41.31,13.88 41.31,13.26 H4.2 ; C5.1 8.84,2.78 6.97,2.78 6.16,3.58 U6.5
  Top Layer w0.381: U4.2 15.35,3.12 v1(15.34,3.14) ; v1(15.39,4.37) 15.41,4.39 U4.3
  Top Layer w0.508: 9.04,3.43 8.28,4.2 8.28,4.91 T1.1 8.08,5.35 ; 9.04,3.43 9.04,4.15 9.31,4.43 9.31,8.23 10.64,9.55 10.73,9.46 11.64,9.46 v1(11.84,9.25) 12.32,8.77 14.64,8.77 14.82,8.59 C2.2 ; 9.04,3.43 C5.1 ; v1(18.39,16.22) 18.76,16.22 ; C2.2 14.92,7.72 14.99,7.72 ; C2.2 14.89,7.89
  Bottom Layer w0.508: v1(11.84,9.25) 11.84,10.21 14.23,12.6 v1(14.7,12.6) 14.8,12.7 14.8,13.31 17.72,16.22 v1(18.39,16.22) ; v1(15.03,7.72) 15.03,4.72 v1(15.39,4.37) 15.39,3.19 v1(15.34,3.14)
F2DAT: length 11.2
  Top Layer w0.203: U1.12 19.79,13.48 19.79,13.88 19.97,14.06 20.5,14.06 20.9,13.67 23.9,13.67 v1(24.12,13.44)
  Bottom Layer w0.203: v1(24.12,13.44) 24.12,10.8 24.61,10.31 26.54,10.31 26.76,10.08 R2.2
F3CLK: length 10.5
  Top Layer w0.203: v1(22.62,12.7) 22.46,12.86 U1.10
  Bottom Layer w0.203: R3.2 27.59,8.84 24.61,8.84 23.23,10.21 23.23,12.09 v1(22.62,12.7)
ILLU: length 21.3
  Top Layer w0.203: v1(38.58,9.25) 38.58,8.75 38.25,8.43 22.02,8.43 21.3,9.14 19.93,9.14 19.4,9.68 U1.3
LED: length 14.9
  Top Layer w0.203: v1(33.14,9.3) 33.17,9.3 33.22,9.25 32.78,9.25 32.38,8.84 22.32,8.84 21.6,9.56 20.18,9.56 19.8,9.94 U1.4
MA: length 10.9
  Top Layer w0.203: U4.6 11.96,4.39 14.63,7.05 16.41,7.05 16.99,7.63 16.99,9.1 17.21,9.32 17.21,9.52 17.79,10.1 17.79,11.16 17.89,11.27 U1.20
MB: length 12.3
  Top Layer w0.203: U1.1 18.6,10.1 17.6,9.09 17.6,7.25 16.99,6.65 14.88,6.65 13.07,4.84 13.07,3.65 12.54,3.12 U4.7
PHOLD: length 9.2
  Top Layer w0.203: 16.06,20.86 15.85,20.66 15.85,18.84 16.71,17.98 16.71,15.57 R16.1 17.4,14.77 18.1,14.07 18.81,14.07 19,13.89 U1.14
POSA: length 6.1
  Top Layer w0.203: U1.18 17.97,12.08 17.53,12.08 16.97,11.53 16.97,11.07 16.57,10.67 14.08,10.67 13.4,9.99 13.4,9.65
POSB: length 2.9
  Top Layer w0.203: U1.19 17.6,11.67 17.37,11.44 17.37,10.76 16.4,9.79 16.4,9.65
RXD: length 11.6
  Top Layer w0.203: U1.8 21.38,12.06 21.76,11.68 29.79,11.68 30.14,11.33 v1(30.14,10.35)
  Bottom Layer w0.203: v1(30.14,10.35) 30.14,9.39 U2.1
TXD: length 13.5
  Top Layer w0.203: H2.3 33.13,12.33 32.89,12.09 22.09,12.09 21.72,12.47 U1.9
VH: length 25.9
  Top Layer w0.203: TP2.1 3.09,14.83 3.68,14.83
  Top Layer w1.27: H12.1 1.9,20.68 1.9,17.58 3.37,16.1 3.37,15.14 3.68,14.83 R5.2
  Bottom Layer w0.254: D1.1 8.66,12.81 8.66,16.35 R13.2
  Bottom Layer w0.7: C3.2 6.74,11.82 7.26,11.82
  Bottom Layer w1.27: H12.1 1.87,17.78 1.75,17.65 3.42,15.98 3.42,14.98 3.92,14.48
  vias: v1(4.08,14.48)
VHCTL: length 21.9
  Top Layer w0.203: U6.1 5.25,1.13 v1(4.84,1.13) ; U1.2 19,9.58 18,8.58 18,6.96 17.34,6.29 15.34,6.29 13.61,4.56 13.61,2.23 12.45,1.06 v1(10.92,1.06)
  Bottom Layer w0.203: v1(10.92,1.06) 4.91,1.06 v1(4.84,1.13)
VHSAMP: length 13.5
  Top Layer w0.203: U1.16 15.45,12.86 14.45,13.87 12.26,13.87 12.26,13.86 10.21,13.86 9.16,12.81 R7.1 7.74,12.81 7.02,12.09 R8.2
VM: length 16.4
  Top Layer w0.203: TP3.1 3.85,12.64 4.12,12.38
  Top Layer w0.381: 4.12,12.38 3.94,12.21 3.81,12.21
  Bottom Layer w0.381: 9.76,12.7 C9.1 10.14,13.19 11.8,14.85 11.8,15.66 Q4.3 12.77,14.87 R12.2 ; D2.1 4.43,11.62
  Bottom Layer w0.508: 9.76,12.7 9.76,10.96 8.7,9.9 6.42,9.9 4.7,11.62 4.43,11.62
  vias: v1(3.71,12.3)
~F1SYNC: length 8
  Top Layer w0.203: v1(23.41,13.03) 23.12,13.31 20.36,13.31 U1.11
  Bottom Layer w0.203: R1.2 24.67,9.53 23.69,10.52 23.69,12.74 v1(23.41,13.03)
~FIRE: length 6.9
  Top Layer w0.203: U1.17 15.48,12.47 14.8,11.79 13.28,11.79 12.81,11.32 R14.1
~PON: length 5.6
  Top Layer w0.203: U7.1 16.04,14.87 16.78,14.12 17.39,14.12 18.04,13.47 U1.15
$1N643: length 12
  Top Layer w0.203: R9.2 3.86,5.13 T1.2
  Top Layer w0.381: v1(4.04,8.69) 3.7,8.69 T1.3
  Top Layer w0.508: U6.4 5.63,5.35 T1.2 T1.3
  Bottom Layer w0.381: D2.2 4.04,6.93 v1(4.04,8.69)
$1N5863: length 1.7
  Top Layer w0.203: U5.5 20.5,27.12 20.14,27.47 R6.2
$1N5963: length 6.2
  Top Layer w0.508: 19.87,23.05 20.5,23.68 U5.4 ; 19.87,23.05 19.18,23.05 19.15,23.01 ; 19.87,23.05 20.64,23.05 20.94,22.76 20.94,20.35 H5.2
$1N6542: length 19.1
  Top Layer w1.27: H8.1 3.83,23.62 5.1,24.89 7.59,24.89 8.43,24.05 Q7.2
  Bottom Layer w0.381: R13.1 7.79,19.36 7.79,20.78 8.43,21.41 Q7.2
  Bottom Layer w0.508: Q7.2 8.43,23.76 9.28,24.61 C10.1
$1N7917: length 4.9
  Top Layer w0.381: H6.1 18.72,4.58 18.03,3.89 18.03,2.23 17.65,1.85 U4.1
$1N7926: length 3
  Top Layer w0.381: U4.4 18.78,5.66 19.21,6.08 H6.2
$1N9133: length 36.3
  Top Layer w0.203: v1(20.24,16.2) 20.39,16.05 20.39,15.44 21.16,14.67 v1(23.21,14.67) ; U5.1 17.4,26.48 v1(17.39,26.47)
  Bottom Layer w0.203: H7.1 37.95,13.93 37.79,14.1 23.78,14.1 v1(23.21,14.67) ; v1(17.39,26.47) 17.39,26.06 18.76,24.69 18.76,19 20.24,17.53 v1(20.24,16.2)
  Bottom Layer w0.254: Q2.3 35.49,11.07 36.56,12.14 36.89,12.14 H7.1
$1N9861: length 1.9
  Bottom Layer w0.203: H4.1 42.87,13.1 R4.2
$1N10113: length 4.2
  Bottom Layer w0.254: H7.2 39.47,13.2 39.47,12.37 39.29,12.19 37.65,12.19 36.98,11.53 R10.2
$1N11768: length 9.4
  Top Layer w0.203: D3.1 10.95,15.55 Q5.3
  Bottom Layer w0.203: Q4.1 10.04,14.8 10.92,15.67 10.92,17.11 v1(11.01,17.2) 11.02,17.2 Q8.1
  Bottom Layer w0.381: Q8.1 13.56,16.47 R12.1
$1N12606: length 2.2
  Bottom Layer w0.254: R1.1 25.28,11.08 H1.4
$1N12608: length 2.2
  Bottom Layer w0.254: R2.1 26.78,11.05 H1.3
$1N12610: length 2.2
  Bottom Layer w0.254: R3.1 28.29,13.2 H1.2
$1N12900: length 1.9
  Bottom Layer w0.203: Q1.3 40.49,10.39 40.49,11.22 40.64,11.37 R4.1
$1N13119: length 1.8
  Top Layer w0.254: Q5.1 10.7,11.87 10.16,11.32 R14.2
$1N13261: length 3.2
  Bottom Layer w0.381: T2.1 11.31,26.55 12.8,26.55 13.31,27.06 C10.2
$1N13316: length 2.4
  Bottom Layer w0.381: H9.1 3.69,27.5 T2.3
$1N19831: length 12
  Top Layer w0.203: U7.2 14.24,17.21 14.25,17.21 15.09,18.05 15.09,21.37 15.3,21.58 15.3,21.59 15.55,21.84 16.38,21.84 16.63,21.59 16.63,21.03 16.88,20.78 18.14,20.78 19,19.91 R11.1 19.26,18.67 19.71,18.22
$1N20494: length 5
  Bottom Layer w0.381: Q4.2 9.89,18.28 R15.1 10.44,18.3 10.89,18.75 10.89,19.76 11.13,20 Q8.2
$1N20508: length 3.1
  Bottom Layer w0.381: Q7.1 10.97,21.56 9.87,20.47 R15.2
$1N20541: length 4.2
  Top Layer w0.203: R7.2 8.59,15.33 7.98,15.94 6.6,15.94 5.92,15.26 R5.1
$1N21098: length 2
  Top Layer w0.381: v1(7.89,7.52) 7.84,7.57 T1.5
  Bottom Layer w0.381: v1(7.89,7.52) 7.46,7.09 D1.2
$1N21327: length 4.9
  Bottom Layer w0.254: H2.2 34.63,12.32 34.45,12.14 32.81,12.14 32.18,11.51 U2.3
$1N21479: length 8.1
  Top Layer w0.203: v1(15.11,16) 15.11,15.96 15.09,15.94 U7.3
  Top Layer w0.254: v1(17.8,16.97) 18.2,17.37 20.84,17.37 21.32,17.84 H10.2
  Bottom Layer w0.254: v1(17.8,16.97) 17.09,16.97 16.53,16.41 15.51,16.41 v1(15.11,16)
$1N28229: length 5.4
  Top Layer w0.203: U6.3 7.4,0.79 7.11,0.5 4.57,0.5 3.86,1.21 R9.1

## Copper pours and planes (outline as drawn; the poured copper is in the pictures)
GND on Top Layer: 15.08,29 15.08,23.5 15.11,23.47 13.79,22.15 13.79,20.68 13.74,20.62 13.79,20.64 14,18.72 13.11,17.51 13.11,13.86 10.48,13.86 10.48,5.23 10.38,5.13 1.9,5.13 2,5.07 1.99,0.76 1.99,0 17.85,0 18,0.15 18,1.37 18.1,1.47 18.87,1.47 21.46,4.06 21.46,7.92 21.56,8.03 43.86,8.03 44.01,8.25 44.01,14.43 43.86,14.58 24.15,14.58 24.05,14.63 24.05,20.75 21.5,20.75 21.5,29
GND on Bottom Layer: 21.5,29 15.05,29 15.06,13.49 9.31,7.6 9.31,5.07 1.98,5.07 1.98,0.53 2.51,0 17.56,0 21.5,3.9 21.5,7.92 21.66,8.08 44.05,8 44.05,14.24 43.79,14.5 24.22,14.5 24.12,14.8 24.12,20.62 21.5,20.62

# Board PCB2
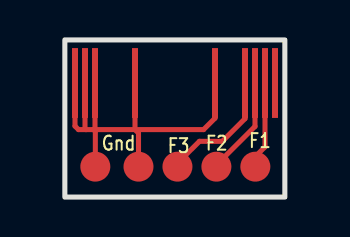
[diagram p3: board, top side]
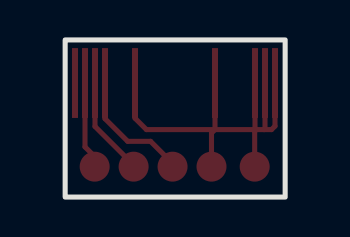
[diagram p4: board, bottom side, seen from below]

Outline 11 x 7.87 mm; copper layers: Top Layer, Bottom Layer. Coordinates in mm from the lower left corner of the outline.
Outline path: rectangle 0,7.87 11,0
Stack: Top Layer 0.035mm / Dielectric1 1.51mm FR4 er 4.5 / Bottom Layer 0.035mm

## Design rules (mm)
template: JLCPCB Capability(Two Layers Board)
spacing copperThickness1oz (default): track to track 0.102, other pairs 0.152 to 0.3
spacing copperThickness2oz: track to track 0.203, other pairs 0.152 to 0.3
track width copperThickness1oz (default): min 0.127, default 0.254, max 2.54
track width copperThickness2oz: min 0.203, default 0.254, max 2.54
differential pair differentialPair (default): width min 0.127, default 0.254, max 2.54; gap min 0.152, default 0.152
via viaSize (default): diameter min 0.5, default 0.61, max 10; hole min 0.3, default 0.305, max 6.3

## Placement (name value [footprint] x y rotation side)
NOREF  -  [Pad_e64]  9.53 1.52 0 top
NOREF#2  -  [Pad_e62]  5.63 1.52 0 top
NOREF#3  -  [Pad_e23]  1.51 5.72 0 top
NOREF#4  -  [Pad_e170]  3.68 1.52 0 top
NOREF#5  -  [Pad_e162]  1.52 1.52 0 top
NOREF#6  -  [Pad_e22]  1.01 5.72 0 top
NOREF#7  -  [Pad_e1]  0.51 5.72 0 top
NOREF#8  -  [Pad_e40]  10.01 5.72 0 top
NOREF#9  -  [Pad_e39]  9.51 5.72 0 top
NOREF#10  -  [Pad_e63]  7.58 1.52 0 top
NOREF#11  -  [Pad_e35]  7.51 5.72 0 top
NOREF#12  -  [Pad_e41]  10.51 5.72 0 top
NOREF#13  -  [Pad_e38]  9.01 5.72 0 top
NOREF#14  -  [Pad_e27]  3.51 5.72 0 top

## Footprints (pads in the part's own frame, mm; a bottom-side part is the same pattern mirrored in y, then rotated)
Pad_e1
  rect 0.3x3.5 smd: 1(0,0)
Pad_e22
  rect 0.3x3.5 smd: 2(0,0)
Pad_e23
  rect 0.3x3.5 smd: 3(0,0)
Pad_e27
  rect 0.3x3.5 smd: 7(0,0)
Pad_e35
  rect 0.3x3.5 smd: 15(0,0)
Pad_e38
  rect 0.3x3.5 smd: 18(0,0)
Pad_e39
  rect 0.3x3.5 smd: 19(0,0)
Pad_e40
  rect 0.3x3.5 smd: 20(0,0)
Pad_e41
  rect 0.3x3.5 smd: 21(0,0)
Pad_e62
  round 1.5 smd: F3(0,0)
Pad_e63
  round 1.5 smd: F2(0,0)
Pad_e64
  round 1.5 smd: F1(0,0)
Pad_e162
  round 1.5 smd: Gnd(0,0)
Pad_e170
  round 1.5 smd: Gnd(0,0)

## Nets

Pads without a net: NOREF F1; NOREF#2 F3; NOREF#3 3; NOREF#4 Gnd; NOREF#5 Gnd; NOREF#6 2; NOREF#7 1; NOREF#8 20; NOREF#9 19; NOREF#10 F2; NOREF#11 15; NOREF#12 21; NOREF#13 18; NOREF#14 7

## Routing (per net, layer and track width the routed paths; a pad name or vN(x,y) marks a point on that pad's centre or on a via; arc(x,y) is an arc through that point)
(no net): length 37.6
  Top Layer w0.254: 1.44,3.38 1.51,3.45 NOREF#3.3 ; 1.44,3.38 1.06,3.38 ; 1.44,3.38 3.51,3.38 ; 1.44,3.38 1.52,3.3 NOREF#5.Gnd ; 1.06,3.38 1.01,3.43 NOREF#6.2 ; 1.06,3.38 0.68,3.38 0.51,3.56 NOREF#7.1 ; NOREF#4.Gnd 3.68,3.21 3.51,3.38 ; NOREF#14.7 3.51,3.38 ; 3.51,3.38 6.94,3.38 7.51,3.95 NOREF#11.15 ; 7.75,1.52 7.75,1.78 9.51,3.54 NOREF#9.19 ; NOREF.F1 9.53,2.03 10.01,2.52 NOREF#8.20 ; 5.8,1.52 5.8,1.86 6.73,2.79 7.87,2.79 9.01,3.93 NOREF#13.18

## Text on the board
Top Silkscreen Layer: Gnd | F3 | F2 | F1
